# EAGLE design ethernetGateway (EAGLE 6.4)
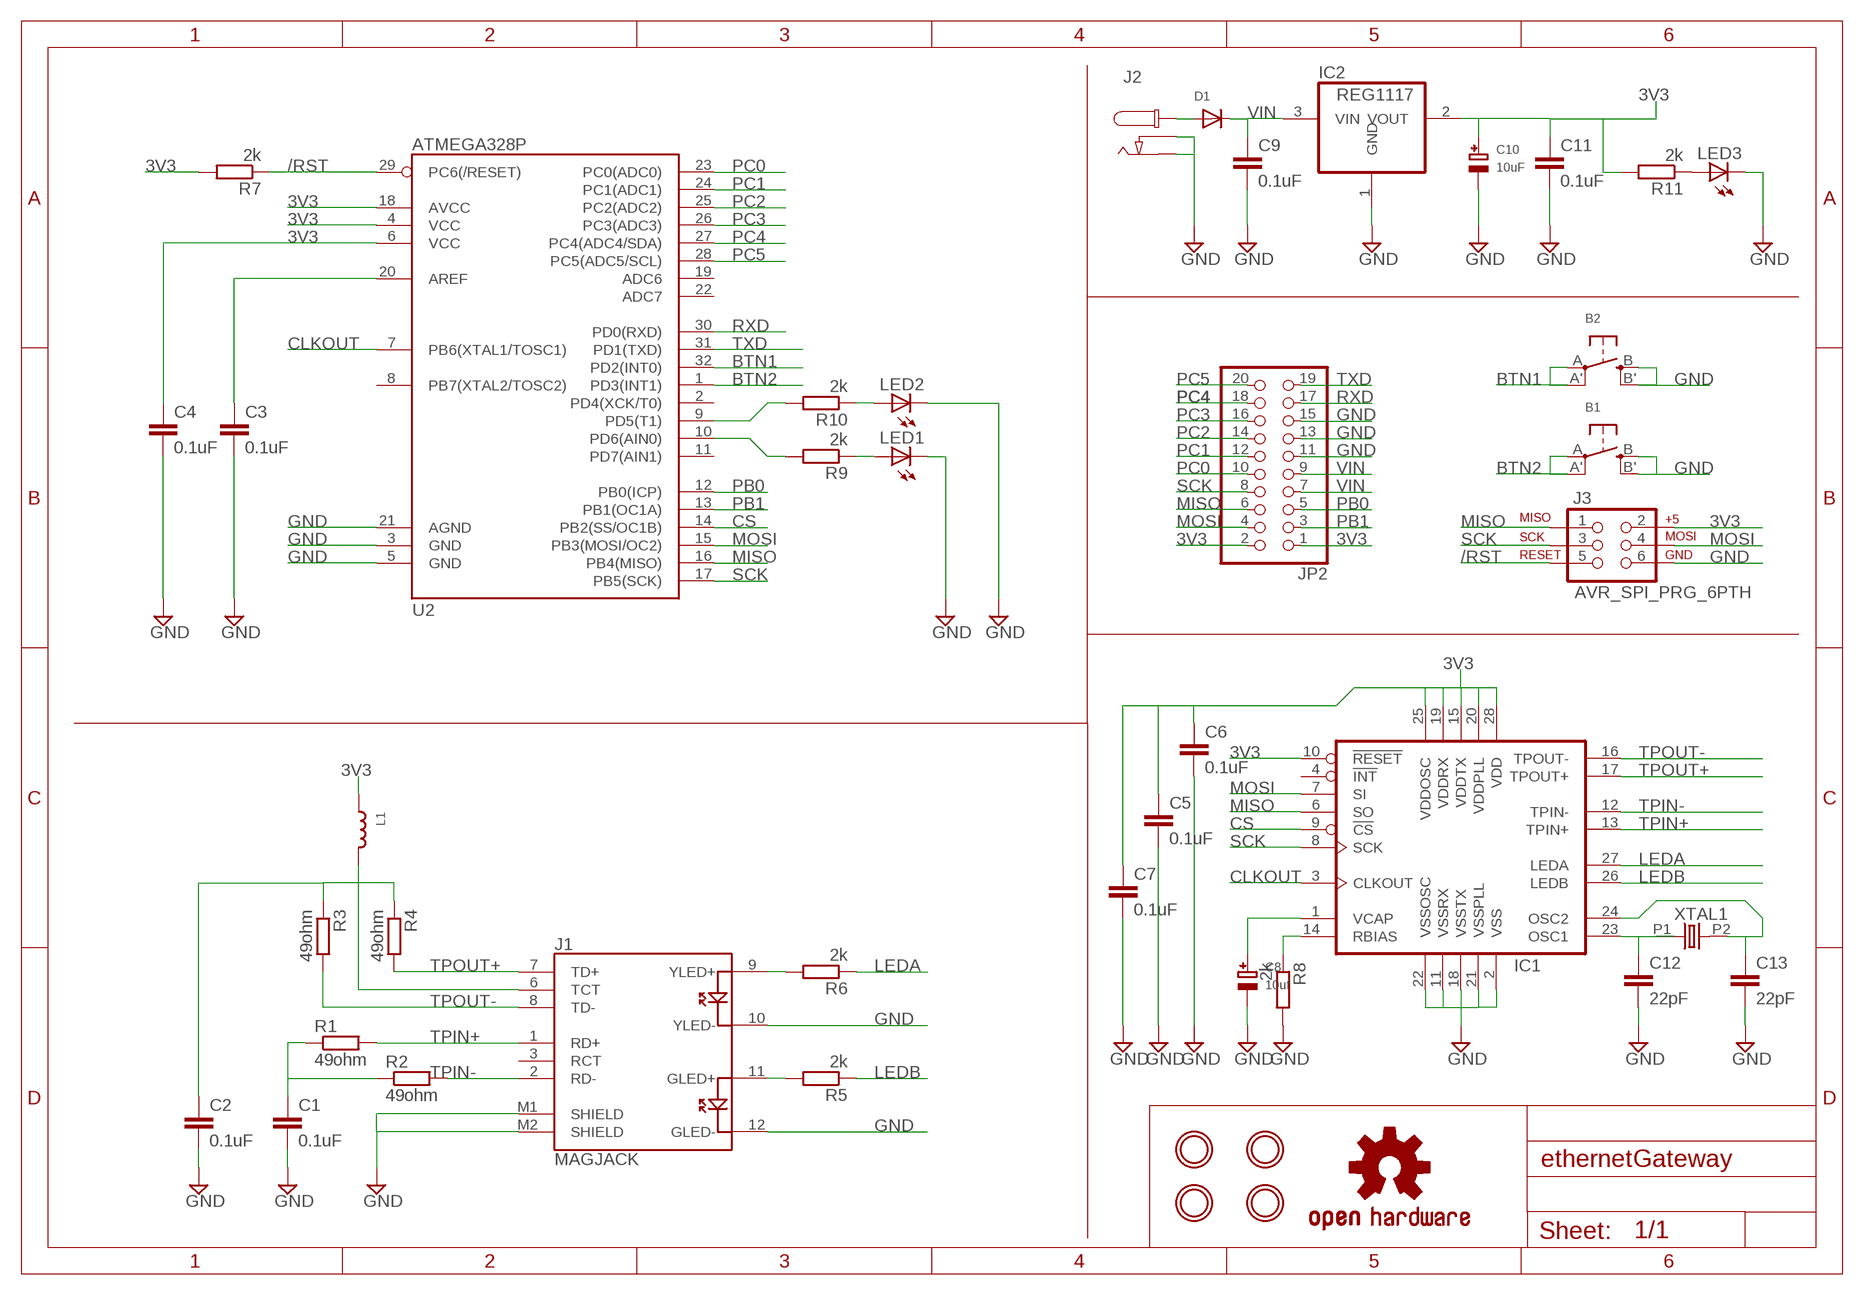
[diagram p0: schematic, sheet 1]

## Parts
B1  SWITCH_TACT_SMT4.6X2.8  [BTN_KMR2_4.6X2.8]
B2  SWITCH_TACT_SMT4.6X2.8  [BTN_KMR2_4.6X2.8]
C1  0.1uF  C-EUC0805  [C0805]
C2  0.1uF  C-EUC0805  [C0805]
C3  0.1uF  C-EUC0805  [C0805]
C4  0.1uF  C-EUC0805  [C0805]
C5  0.1uF  C-EUC0805  [C0805]
C6  0.1uF  C-EUC0805  [C0805]
C7  0.1uF  C-EUC0805  [C0805]
C8  10uf  CAP_TANTALUMB/3528_WAVE  [EIA3528-21/B-W]
C9  0.1uF  C-EUC0805  [C0805]
C10  10uF  CAP_TANTALUMB/3528_WAVE  [EIA3528-21/B-W]
C11  0.1uF  C-EUC0805  [C0805]
C12  22pF  C-EUC0805  [C0805]
C13  22pF  C-EUC0805  [C0805]
D1  DIODEDO-1N4148  [DO-1N4148]
IC1  IC_ENC28J60-SOIC-28  [SOIC-28W]
IC2  REG1117  [SOT223]
J1  MAGJACK  [MAGJACK]
J2  CON_DC_M-DC_PTH  [DC_BARREL_JACK_PTH_2MM]
J3  AVR_SPI_PRG_6PTH  [2X3]
JP2  PINHD-2X10  [2X10]
L1  INDUCTOR0805  [0805]
LED1  LED-0805  [LED-805]
LED2  LED-0805  [LED-805]
LED3  LED-0805  [LED-805]
LOGO1  OSHW-LOGOL  [OSHW-LOGO-L]
R1  49ohm  R-EU_R0805  [R0805]
R2  49ohm  R-EU_R0805  [R0805]
R3  49ohm  R-EU_R0805  [R0805]
R4  49ohm  R-EU_R0805  [R0805]
R5  2k  R-EU_R0805  [R0805]
R6  2k  R-EU_R0805  [R0805]
R7  2k  R-EU_R0805  [R0805]
R8  2k  R-EU_R0805  [R0805]
R9  2k  R-EU_R0805  [R0805]
R10  2k  R-EU_R0805  [R0805]
R11  2k  R-EU_R0805  [R0805]
U2  ATMEGA328P  ATMEGA328_SMT  [TQFP32-08]
U$1  MOUNTINGHOLE2.0  [MOUNTINGHOLE_2.0_PLATED]
U$2  MOUNTINGHOLE2.0  [MOUNTINGHOLE_2.0_PLATED]
U$3  MOUNTINGHOLE2.0  [MOUNTINGHOLE_2.0_PLATED]
U$4  MOUNTINGHOLE2.0  [MOUNTINGHOLE_2.0_PLATED]
XTAL1  OSC-XTAL-HC-49U-PTH  [HC-49U-PTH]

## Nets
3V3: C4.1 C5.1 C6.1 C7.1 C10.+ C11.1 IC1.10(!RESET) IC1.15(VDDTX) IC1.19(VDDRX) IC1.20(VDDPLL) IC1.25(VDDOSC) IC1.28(VDD) IC2.2(VOUT) J3.2 JP2.1 JP2.2 L1.1 R7.2 R11.2 U2.4(VCC) U2.6(VCC) U2.18(AVCC)
/RST: J3.5 R7.1 U2.29(PC6(/RESET))
BTN1: B2.A'(P1) B2.A(P) U2.32(PD2(INT0))
BTN2: B1.A'(P1) B1.A(P) U2.1(PD3(INT1))
CLKOUT: IC1.3(CLKOUT) U2.7(PB6(XTAL1/TOSC1))
CS: IC1.9(!CS) U2.14(PB2(SS/OC1B))
GND: B1.B'(S1) B1.B(S) B2.B'(S1) B2.B(S) C1.2 C2.2 C3.2 C4.2 C5.2 C6.2 C7.2 C8.- C9.2 C10.- C11.2 C12.2 C13.2 IC1.2(VSS) IC1.11(VSSRX) IC1.18(VSSTX) IC1.21(VSSPLL) IC1.22(VSSOSC) IC2.1(GND) J1.10(YLED-) J1.12(GLED-) J1.M1(SHIELD) J1.M2(SHIELD) J2.P2(P3) J2.P3(P2) J3.6 JP2.11 JP2.13 JP2.15 LED1.C LED2.C LED3.C R8.2 U2.3(GND) U2.5(GND) U2.21(AGND)
LEDA: IC1.27(LEDA) R6.1
LEDB: IC1.26(LEDB) R5.1
MISO: IC1.6(SO) J3.1 JP2.6 U2.16(PB4(MISO))
MOSI: IC1.7(SI) J3.4 JP2.4 U2.15(PB3(MOSI/OC2))
N$1: C1.1 R1.1 R2.1
N$2: J1.9(YLED+) R6.2
N$3: C13.1 IC1.24(OSC2) XTAL1.P2
N$4: J1.11(GLED+) R5.2
N$5: C12.1 IC1.23(OSC1) XTAL1.P1
N$7: C2.1 J1.6(TCT) L1.2 R3.1 R4.1
N$10: C8.+ IC1.1(VCAP)
N$12: C3.1 U2.20(AREF)
N$13: IC1.14(RBIAS) R8.1
N$16: LED1.A R9.1
N$17: LED2.A R10.1
N$19: D1.A J2.P1
N$23: R10.2 U2.9(PD5(T1))
N$24: R9.2 U2.10(PD6(AIN0))
N$28: LED3.A R11.1
PB0: JP2.5 U2.12(PB0(ICP))
PB1: JP2.3 U2.13(PB1(OC1A))
PC0: JP2.10 U2.23(PC0(ADC0))
PC1: JP2.12 U2.24(PC1(ADC1))
PC2: JP2.14 U2.25(PC2(ADC2))
PC3: JP2.16 U2.26(PC3(ADC3))
PC4: JP2.18 U2.27(PC4(ADC4/SDA))
PC5: JP2.20 U2.28(PC5(ADC5/SCL))
RXD: JP2.17 U2.30(PD0(RXD))
SCK: IC1.8(SCK) J3.3 JP2.8 U2.17(PB5(SCK))
TPIN+: IC1.13(TPIN+) J1.1(RD+) R1.2
TPIN-: IC1.12(TPIN-) J1.2(RD-) R2.2
TPOUT+: IC1.17(TPOUT+) J1.7(TD+) R4.2
TPOUT-: IC1.16(TPOUT-) J1.8(TD-) R3.2
TXD: JP2.19 U2.31(PD1(TXD))
VIN: C9.1 D1.C IC2.3(VIN) JP2.7 JP2.9
Unconnected: IC1.4(!INT) J1.3(RCT) U2.2(PD4(XCK/T0)) U2.8(PB7(XTAL2/TOSC2)) U2.11(PD7(AIN1)) U2.19(ADC6) U2.22(ADC7)

## Library data of the parts
B1 B2 = microbuilder:SWITCH_TACT_SMT: SMT Tact Switches 6x6mm - Digikey: P12940SCT-ND KMR2 (4.6x2.8mm) - Digikey: 401-1426-1-ND EVQ-PQHB55 - Light Touch, 160GF (4.5x4.5mm) - Digikey: P8090SCT-ND
C1-C7 C9 C11-C13 = rcl:C-EU: CAPACITOR, European symbol
C8 C10 = microbuilder:CAP_TANTALUM: Tantalum Capacitors Wave footprints have larger pads and are meant to be used for hand soldering. Reflow footprints are optimised for solder paste and a reflow oven. EIA3216-18/A-[R/W] - Size A / 3216-18 / 1206 footprint 4.7µF 25V 10% Tantalum Capacitor 10µF 16V 10% Tantalum Capacitor [Digikey: 495-2236-2-ND] EIA3528-21/B-[R/W] - Size B / 3528-21 47µF 10V 10% Tantalum Capactior [Digikey: 495-2216-1-ND] EIA6032-28/C-[R/W] - Size C / 6032-28 10µF 35V 20% Tantalum Capacitor [Digikey: 495-2285-1-ND] 100µF 16V 10% Tantalum Capactior [Digikey: 399-5214-1-ND]
D1 = microbuilder:DIODE: Diode SMA Model Volts Amps Type Vf Vr Digikey # Notes SSA34-E3 40V 3A Schottky 480mV @ 3A 200uA @ 40V SSA34-E3/61TGITR-ND CDBA120-G 20V 1A Schottky 500mV @ 1A 500uA @ 20V 641-1014-6-ND REEL MBRA210 10V 2A Schottky 350mV @ 2A 700uA @ 10V MBRA210LT3 SOD-123 Model Volts Amps Type Vf Vr Order # Notes BAT54T1G 30V 200mA Schottky 800mV @ 200mA 2uA @ 25V BAT54T1GOSTR-ND B0530W 30V 500mA Schottky 430mV @ 500mA 130uA @ 30V B0530W-FDICT-ND REEL MBR120 1A 20V Schottky 340mV @ 1A MBR120VLSFT1GOSCT-ND SOD-323 Model Volts Amps Type Vf Vr Order # Notes PMEG2005EJ 20V 500mA Schottky 355mV @ 500mA 568-4110-1-ND ZLLS410 10V 570mA Schottky 380mV @ 570mA ZLLS410CT-ND 1N4148WS 75V 150mA Silicon/Simple 1V 1N4148WSFSCT-ND REEL SOD-523 Model Volts Amps Type Vf Vr Order # Notes BAT54XV2 30V 200mA Schottky 0.8V @ 100mA BAT54XV2CT-ND TB751S 30V 30mA Schottky RB751S-40TE61CT-ND SOT23-R/W (R = Solder Paste/Reflow Ovens, W = Hand-Soldering) Model Volts Amps Type Vf Vr Order # Notes BAT54FILM 40V 300mA Schottky 497-7162-1-ND
IC1 = dp_devices:IC_ENC28J60: Ethernet Controller with SPI Interface
IC2 = burr-brown:REG1117: 800mA and 1A Low Dropout (LDO) Positive Regulator 1.8V, 2.5V, 2.85V, 3.3V, 5V, and Adj; MPN: REG1117; OC_FARNELL: 1097566; OC_NEWARK: 14P6981
J1 = SparkFun-Connectors:MAGJACK: RJ-45 with LEDs
J2 = dp_devices:CON_DC_M: DC power connector
J3 = SparkFun-Connectors:AVR_SPI_PRG_6: AVR ISP 6 Pin This is the reduced ISP connector for AVR programming. Common on Arduino. This footprint will take up less PCB space and can be used with a 10-pin to 6-pin adapter such as SKU: BOB-08508
JP2 = pinhead:PINHD-2X10: PIN HEADER
L1 = microbuilder:INDUCTOR: Inductors 0603: 10nH Ceramic Inductor - microwire antenna/RF (Digikey: 712-1434-2-ND) 0805: 560nH Ceramic Inductor - RF (Digikey: 553-1047-1-ND) 270nH Ceramic Inductor - Q = 40@250MHz, +-5%, 1 Ohm DC Resistance (Digikey: 535-10506-2-ND) 1007 (2518 Metric) SMT: 10µH 10% 250mOhm 820mA 1007 Inductor (Digikey: 587-2189-1-ND) 22µH 10% 500mOhm 580mA 1007 Inductor (Digikey: 587-2190-1-ND) 47µH 10% 950mOhm 420mA 1007 Inductor (Digikey: 587-2191-1-ND) 47µH 5% 100mOhm 1A 1008 Inductor (Digikey: 732-1816-1-ND) 5.0x5.0mm (Taiyo Yuden NR5040 Series) 6.8µH 20% 2.3A 64mOhm Inductor (Digikey: 587-2374-2-ND) 5.0x5.0mm (TDK VLC5045 Series) 4.7µH 20% 3.3A 34mOhm Inductor (Digikey: 445-6526-1-ND) 6.8µH 20% 2.7A 46mOhm Inductor (Digikey: 445-6527-1-ND) 6.0x6.0mm (TDK VLC6045 Series) 4.7µH 20% 3.8A 27mOhm Inductor (Digikey: 445-6538-2-ND) 6.8µH 20% 3A 41mOhm Inductor (Digikey: 445-6540-1-ND) 6.2µH 30% 2.2A 45mOhm Inductor (Digikey: SRR5028-6R2YCT-ND) - Not TDK VLC6045 but footprint should match 6.0x6.0mm (TDK SLF6045 Series) 6.8uH 30% 2A 33mOhm Inductor (Digikey: 445-4572-1-ND, Mouser: 810-SLF645T6R8N2R0PF)
LED1-LED3 = dp_devices:LED: Light Emitting Diode
LOGO1 = SparkFun-Aesthetics:OSHW-LOGO: Open Source Hardware Logo This logo indicates the piece of hardware it is found on incorporates a OSHW license and/or adheres to the definition of open source hardware found here: http://freedomdefined.org/OSHW
R1-R11 = rcl:R-EU_: RESISTOR, European symbol
U2 = SparkFun-DigitalIC_ihsan:ATMEGA328_SMT: 32-Pin Atmega328 part Commonly used on Arduino compatible boards Available in QFP and QFN packages TQFP is IC-09069 QFN is non-stock; PROD_ID: IC-09069
U$1-U$4 = microbuilder:MOUNTINGHOLE: Mounting Hole For #2 screws (0.086"/2.18mm width, 0.094"/2.4mm hole) use 2.5mm
XTAL1 = dp_devices:OSC-XTAL

## Board
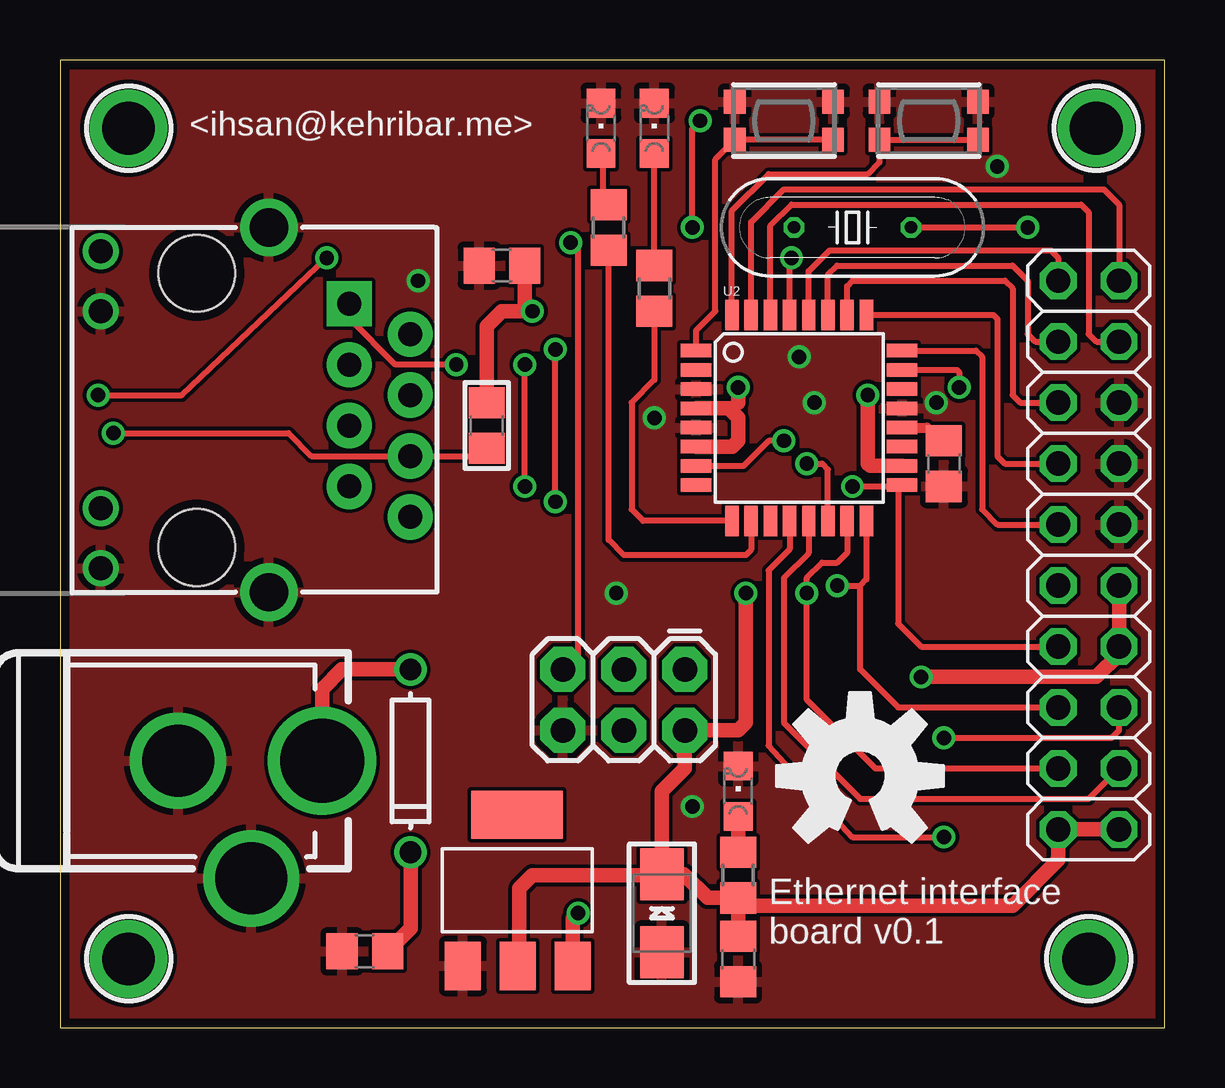
[diagram p1: board, top side]
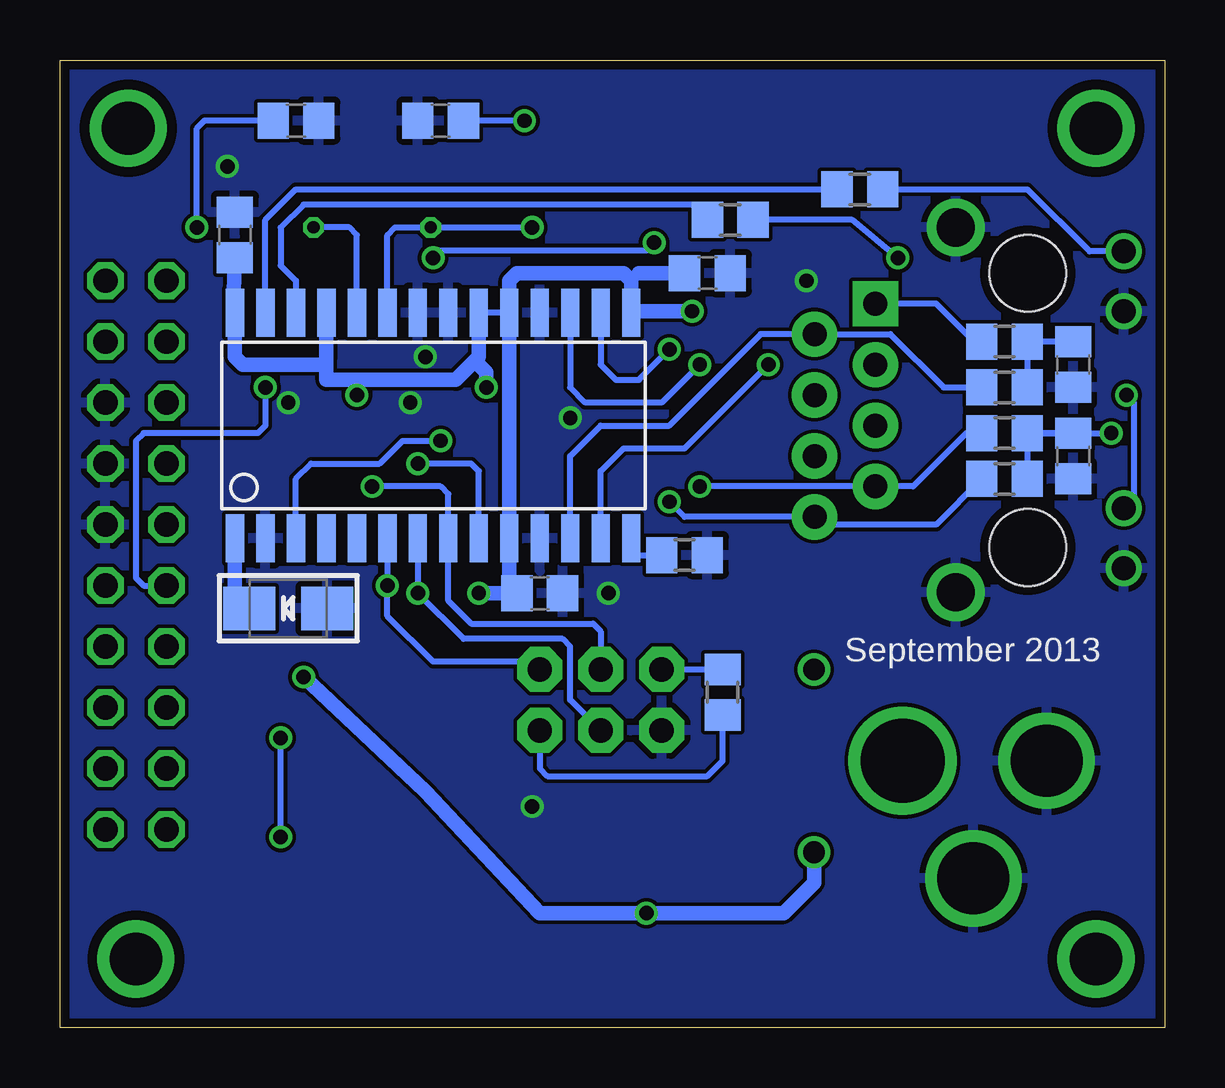
[diagram p2: board, bottom side, seen from below]

Size 46.02 x 40.31 mm. Coordinates in mm from the lower left corner, seen from the top.
Outline: 0,0 46.02,0 46.02,40.31 0,40.31 0,0
Copper layers (1*16): Top 0.0356mm / dielectric 1.5011mm / Bottom 0.0356mm
Design rules "LaenPCBOrder": minimum track width 6mil, minimum drill 13mil, track to track 6mil, track to pad 6mil, pad to pad 6mil, via to via 6mil, smd to smd 6mil, copper to edge 15mil, drill to drill 6mil, minimum pad ring 7mil, minimum via ring 7mil, stop-mask expansion 4mil, vias tented up to drill 0mil, thermal gap 10mil

### Footprints (pad centres in the part's own frame; a part is rotated, then mirrored left to right if it is on the bottom)
BTN_KMR2_4.6X2.8 = smd 0.9 x 1: A 2.05,0.8; A' -2.05,0.8; B 2.05,-0.8; B' -2.05,-0.8
C0805 = smd 1.3 x 1.5: 1 -0.95,0; 2 0.95,0
EIA3528-21/B-W = smd 2.15 x 1.8: + 1.625,0; - -1.625,0
DO-1N4148 = drill 0.9: A -3.81,0; C 3.81,0
SOIC-28W = smd 0.762 x 2: 1 -8.89,-4.7; 2 -7.62,-4.7; 3 -6.35,-4.7; 4 -5.08,-4.7; 5 -3.81,-4.7; 6 -2.54,-4.7; 7 -1.27,-4.7; 8 0,-4.7; 9 1.27,-4.7; 10 2.54,-4.7; 11 3.81,-4.7; 12 5.08,-4.7; 13 6.35,-4.7; 14 7.62,-4.7; 15 7.62,4.7; 16 6.35,4.7; 17 5.08,4.7; 18 3.81,4.7; 19 2.54,4.7; 20 1.27,4.7; 21 0,4.7; 22 -1.27,4.7; 23 -2.54,4.7; 24 -3.81,4.7; 25 -5.08,4.7; 26 -6.35,4.7; 27 -7.62,4.7; 28 -8.89,4.7
SOT223 = smd 1.499 x 2.007: 1 -2.261,-3.15; 2 0.025,-3.15; 3 2.311,-3.15 | smd 3.81 x 2.007: 4 0,3.15
MAGJACK = drill 1 pad 1.88 square: 1 3.175,17.445 | drill 1 pad 1.88: 2 4.445,19.985; 3 5.715,17.445; 4 6.985,19.985; 5 8.255,17.445; 6 9.525,19.985; 7 10.795,17.445; 8 12.065,19.985 | drill 1 pad 1.27: 9 1,7.1; 10 3.5,7.1; 11 11.7,7.1; 12 14.2,7.1 | drill 1.6 pad 2.184: M1 0,14.1; M2 15.2,14.1 | hole 3.2: 1.905,11.095; 13.335,11.095
DC_BARREL_JACK_PTH_2MM = drill 3.5: P1 0,6.475 | drill 3: P2 4.9,3.525; P3 0,0.475
2X3 = drill 1.016 pad 1.88 octagon: 1 0,0; 2 0,2.54; 3 2.54,0; 4 2.54,2.54; 5 5.08,0; 6 5.08,2.54
2X10 = drill 1.016 octagon: 1 -11.43,-1.27; 2 -11.43,1.27; 3 -8.89,-1.27; 4 -8.89,1.27; 5 -6.35,-1.27; 6 -6.35,1.27; 7 -3.81,-1.27; 8 -3.81,1.27; 9 -1.27,-1.27; 10 -1.27,1.27; 11 1.27,-1.27; 12 1.27,1.27; 13 3.81,-1.27; 14 3.81,1.27; 15 6.35,-1.27; 16 6.35,1.27; 17 8.89,-1.27; 18 8.89,1.27; 19 11.43,-1.27; 20 11.43,1.27
0805 = smd 1.3 x 1.5: 1 -0.95,0; 2 0.95,0
LED-805 = smd 1.2 x 1.2: A 0,-1.05; C 0,1.05
R0805 = smd 1.3 x 1.5: 1 -0.95,0; 2 0.95,0
TQFP32-08 = smd 1.27 x 0.559: 1 -4.293,2.8; 2 -4.293,2; 3 -4.293,1.2; 4 -4.293,0.4; 5 -4.293,-0.4; 6 -4.293,-1.2; 7 -4.293,-2; 8 -4.293,-2.8; 17 4.293,-2.8; 18 4.293,-2; 19 4.293,-1.2; 20 4.293,-0.4; 21 4.293,0.4; 22 4.293,1.2; 23 4.293,2; 24 4.293,2.8 | smd 0.559 x 1.27: 9 -2.8,-4.293; 10 -2,-4.293; 11 -1.2,-4.293; 12 -0.4,-4.293; 13 0.4,-4.293; 14 1.2,-4.293; 15 2,-4.293; 16 2.8,-4.293; 25 2.8,4.293; 26 2,4.293; 27 1.2,4.293; 28 0.4,4.293; 29 -0.4,4.293; 30 -1.2,4.293; 31 -2,4.293; 32 -2.8,4.293
MOUNTINGHOLE_2.0_PLATED = drill 2.2 pad 3: P$1 0,0
HC-49U-PTH = drill 0.508 octagon: P1 -2.44,0; P2 2.44,0

### Placement (x,y rotation side)
B1  30.16,37.78 180 top
B2  36.2,37.78 180 top
C1  3.81,27.62 270 bottom
C2  3.81,23.81 270 bottom
C3  36.83,23.5 270 top
C4  18.41,31.75 180 top
C5  26.04,18.1 0 bottom
C6  38.73,33.02 90 bottom
C7  19.05,31.43 0 bottom
C8  36.51,17.46 180 bottom
C9  12.7,3.17 180 top
C10  25.08,4.76 90 top
C11  28.26,2.86 270 top
C12  30.16,37.78 180 bottom
C13  36.2,37.78 0 bottom
D1  14.61,11.11 270 top
IC1  29.84,25.08 0 bottom
IC2  19.05,5.71 0 top
J1  -5.4,33.34 270 top
J2  4.45,11.11 270 top
J3  26.04,14.92 180 top
JP2  42.86,19.68 90 top
L1  17.78,25.08 270 top
LED1  22.54,37.47 0 top
LED2  24.77,37.47 0 top
LED3  28.26,9.84 0 top
LOGO1  33.34,10.48 0 top
R1  6.67,28.57 180 bottom
R2  6.67,26.67 180 bottom
R3  6.67,22.86 180 bottom
R4  6.67,24.77 180 bottom
R5  18.1,33.66 0 bottom
R6  12.7,34.92 0 bottom
R7  18.41,13.97 270 bottom
R8  20,19.68 0 bottom
R9  22.86,33.34 270 top
R10  24.77,30.8 270 top
R11  28.26,6.35 270 top
U2  30.8,25.4 0 top
U$1  2.86,2.86 0 top
U$2  2.86,37.47 0 top
U$3  42.86,2.86 0 top
U$4  43.18,37.47 0 top
XTAL1  33.02,33.34 0 top

### Tracks (layer width: path | path; a pad name or v marks a point on that pad's centre or on a via)
3V3  (via drill 0.6)
  Top 0.254: U2.4 27.86,25.8 | 28.02,25.8 28.26,26.04
  Top 0.61: 27.86,25.8 28.26,25.4 28.26,24.45 28.01,24.2 U2.6 | U2.4 28.02,25.8 | 28.26,26.04 v28.26,26.67 | U2.18 33.75,23.4 33.66,23.5 v33.66,26.35 | L1.1 17.78,29.21 18.41,29.84 v19.68,29.84 19.36,29.84 C4.1 | v28.57,18.1 28.57,12.7 28.26,12.38 J3.2 | 26,11.39 26.04,11.11 J3.2 | JP2.1 JP2.2 41.59,6.99 39.69,5.08 28.58,5.08 R11.2 | C10.+ 25.05,6.35 19.68,6.35 19.14,5.8 19.14,2.56 IC2.2 | C10.+ 25.08,9.84 26.04,10.79 J3.2 | C11.1 R11.2 | C10.+ 26,6.39 26.99,5.4 R11.2
  Bottom 0.254: IC1.19 IC1.20 | 34.92,27.94 35.24,27.62 | 22.16,29.84 IC1.15 | 21.91,31.43 22.23,31.11 | 27.3,18.1 C5.1 | 38.8,29.84 IC1.28 | J3.2 26.04,10.79 25.72,10.48 19.05,10.48 18.41,11.11 R7.2
  Bottom 0.61: IC1.20 28.57,27.94 28.73,27.78 | 28.73,27.78 29.53,26.99 33.66,26.99 | 33.66,26.99 34.92,26.99 34.92,27.94 IC1.25 | 35.24,27.62 38.42,27.62 38.73,27.94 IC1.28 | v19.68,29.84 22.16,29.84 | IC1.15 22.23,31.11 22.54,31.43 26.99,31.43 27.3,31.11 IC1.19 IC1.10 27.3,18.1 | v28.26,26.67 28.26,27.3 28.73,27.78 | v33.66,26.35 33.66,26.99 | C7.1 21.91,31.43 | C6.1 38.8,29.84 | C5.1 v28.57,18.1
/RST  (via drill 0.6)
  Top 0.254: J3.5 21.27,14.92 21.59,15.24 21.59,32.38 v21.27,32.7 | U2.29 30.4,31.98 v30.48,32.07
  Bottom 0.254: J3.5 R7.1 | v30.48,32.07 30.16,32.38 21.59,32.38 v21.27,32.7
BTN1
  Top 0.254: U2.32 28,34.03 29.53,35.56 33.66,35.56 34.15,36.05 B2.A B2.A'
BTN2
  Top 0.254: B1.A' B1.A 27.3,36.17 27.3,29.84 26.5,29.05 U2.1
CLKOUT  (via drill 0.6)
  Top 0.254: v30.16,24.45 29.53,24.45 28.48,23.4 U2.7
  Bottom 0.254: IC1.3 36.2,22.86 35.56,23.5 32.7,23.5 31.75,24.45 v30.16,24.45
CS  (via drill 0.6)
  Top 0.254: v31.11,23.5 31.75,23.5 32,23.25 U2.14
  Bottom 0.254: IC1.9 28.57,23.18 28.89,23.5 v31.11,23.5
GND  (via drill 0.6)
  other vias: 30.8,27.94 36.51,26.04 14.92,31.11 31.43,26.04 23.18,18.1 24.77,25.4 26.35,9.21 39.05,35.88
  pour Bottom: 0,0 46.04,0 46.04,40.32 0,40.32
  pour Top: 0,0 46.04,0 46.04,40.32 0,40.32
LEDA
  Bottom 0.254: IC1.27 37.47,33.66 36.2,34.92 R6.1
LEDB
  Bottom 0.254: R5.1 19.68,34.29 35.88,34.29 36.83,33.34 36.83,31.75 36.2,31.11 IC1.26
MISO  (via drill 0.6)
  Top 0.254: v32.38,18.41 33.34,18.41 | U2.16 33.6,18.68 33.34,18.41 | 33.34,18.41 33.34,14.92 34.92,13.34 JP2.6
  Bottom 0.254: IC1.6 v32.38,18.41 32.38,17.14 30.48,15.24 26.35,15.24 J3.1
MOSI  (via drill 0.6)
  Top 0.254: U2.15 32.8,19.78 32.38,19.37 31.75,19.37 31.11,18.73 v31.11,18.1 31.11,13.65 33.97,10.79 JP2.4
  Bottom 0.254: IC1.7 v31.11,18.1 29.21,16.19 25.08,16.19 24.77,15.88 24.77,13.65 J3.4
N$1
  Bottom 0.254: C1.1 R1.1 R2.1
N$2
  Bottom 0.254: R6.2 5.71,34.92 3.13,32.34 J1.9
N$3  (via drill 0.6)
  Top 0.254: XTAL1.P2 v40.32,33.34
  Bottom 0.254: IC1.24 33.66,33.02 33.97,33.34 XTAL1.P2 | v40.32,33.34 40.32,37.47 40.01,37.78 C13.1
N$4  (via drill 0.6)
  Top 0.254: v1.59,26.35 5.08,26.35 v11.11,32.07
  Bottom 0.254: J1.11 1.7,21.7 1.27,21.91 1.27,26.04 v1.59,26.35 | v11.11,32.07 13.02,33.66 R5.2
N$5  (via drill 0.6)
  Top 0.254: v26.35,33.34 26.35,37.47 v26.67,37.78
  Bottom 0.254: IC1.23 32.38,33.02 32.07,33.34 XTAL1.P1 v26.35,33.34 | v26.67,37.78 C12.1
N$7  (via drill 0.6)
  Top 0.254: v2.22,24.77 9.53,24.77 10.48,23.81 J1.6 17.46,23.81 L1.2
  Bottom 0.254: C2.1 R4.1 | R4.1 R3.1 | R4.1 v2.22,24.77
N$10
  Bottom 0.254: IC1.1 38.8,20.38 | 38.73,17.46 C8.+
  Bottom 0.61: 38.8,20.38 38.73,19.37 38.73,17.46
N$12
  Top 0.254: 36.12,25 C3.1
  Top 0.406: U2.20 36.12,25
N$13
  Bottom 0.254: IC1.14 22.23,20 21.91,19.68 R8.1
N$16
  Top 0.254: R9.1 22.64,34.39 22.64,36.32 LED1.A
N$17
  Top 0.254: R10.1 LED2.A
N$19
  Top 0.61: J2.P1 10.92,14.1 11.75,14.92 D1.A
N$23
  Top 0.254: U2.9 24.3,21.11 23.81,21.59 23.81,26.04 24.77,26.99 R10.2
N$24
  Top 0.254: U2.10 28.8,19.91 28.57,19.68 23.5,19.68 22.86,20.32 R9.2
N$28
  Top 0.61: R11.1 LED3.A
PB0  (via drill 0.6)
  Top 0.254: U2.12 30.4,19.92 29.53,19.05 29.53,11.75 33.02,7.94 v36.83,7.94 | v36.83,12.06 43.81,12.06 44.13,12.38 JP2.5
  Bottom 0.254: v36.83,7.94 v36.83,12.06
PB1
  Top 0.254: U2.13 31.2,19.77 30.16,18.73 30.16,12.7 33.34,9.53 42.86,9.53 JP2.3
PC0  (via drill 0.6)
  Top 0.254: U2.23 37.37,27.4 37.47,27.3 v37.47,26.67
  Bottom 0.254: v37.47,26.67 37.47,25.08 37.78,24.77 42.55,24.77 42.86,24.45 42.86,18.73 42.55,18.41 JP2.10
PC1
  Top 0.254: U2.24 38.16,28.2 38.42,27.94 38.42,21.59 39.05,20.95 JP2.12
PC2
  Top 0.254: U2.25 38.89,29.69 39.05,29.53 39.05,23.81 39.37,23.5 JP2.14
PC3
  Top 0.254: U2.26 32.8,30.89 33.02,31.11 39.37,31.11 39.69,30.8 39.69,26.35 40.01,26.04 JP2.16
PC4
  Top 0.254: U2.27 32,31.36 32.38,31.75 39.69,31.75 40.32,31.11 40.32,28.89 40.64,28.57 JP2.18
PC5
  Top 0.254: U2.28 31.2,31.52 32.07,32.38 41.27,32.38 41.59,32.07 JP2.20
RXD
  Top 0.254: U2.30 29.6,33.41 30.48,34.29 42.55,34.29 42.86,33.97 42.86,28.89 43.18,28.57 JP2.17
SCK  (via drill 0.6)
  Top 0.254: v33.02,22.54 34.92,22.54 | 34.92,22.54 35.03,22.54 U2.17 35.5,22.6 34.92,22.54 | 34.92,22.54 34.92,16.83 35.88,15.88 JP2.8
  Bottom 0.254: v33.02,22.54 30.16,22.54 29.84,22.23 IC1.8 29.84,17.78 28.89,16.83 23.81,16.83 23.5,16.51 J3.3
TPIN+  (via drill 0.6)
  Top 0.254: v16.51,27.62 13.97,27.62 12.06,29.53 12.06,30.14 J1.1
  Bottom 0.254: R1.2 7.94,28.57 9.53,30.16 J1.1 | v16.51,27.62 20,24.13 22.54,24.13 23.5,23.18 IC1.13
TPIN-
  Bottom 0.254: R2.2 9.21,26.67 11.43,28.89 J1.2 16.83,28.89 20.64,25.08 23.5,25.08 24.77,23.81 IC1.12
TPOUT+  (via drill 0.6)
  Top 0.254: v19.37,22.54 v19.37,27.62
  Bottom 0.254: R4.2 8.26,24.77 10.48,22.54 J1.7 v19.37,22.54 | v19.37,27.62 20.95,26.04 24.13,26.04 24.77,26.67 IC1.17
TPOUT-  (via drill 0.6)
  Top 0.254: v20.64,21.91 v20.64,28.26
  Bottom 0.254: R3.2 9.53,20.95 14.27,20.95 J1.8 20,21.27 v20.64,21.91 | v20.64,28.26 21.91,26.99 22.86,26.99 23.5,27.62 IC1.16
TXD
  Top 0.254: U2.31 28.8,33.56 30.16,34.92 43.5,34.92 44.13,34.29 JP2.19
VIN  (via drill 0.6)
  Top 0.61: JP2.9 JP2.7 44.13,15.56 43.18,14.61 v35.88,14.61 | D1.C 14.61,4.13 C9.1 13.89,2.93 | IC2.3 21.36,4.53 v21.59,4.76
  Bottom 0.61: v35.88,14.61 30.8,9.84 26.04,4.76 v21.59,4.76 15.88,4.76 14.61,6.03 D1.C

### Text on the board
tPlace: <ihsan@kehribar.me> | Ethernet interface / board v0.1
bPlace: September 2013